# EAGLE design eth-denver-2021-badge (EAGLE 9.6.2)
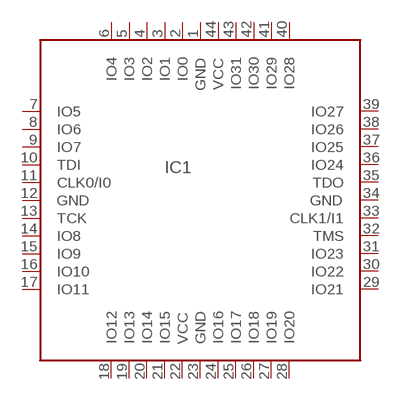
[diagram p0: schematic, sheet 1]

## Parts
IC1  M4-32-P44  [PLCC44]
Unconnected: IC1.2(IO0) IC1.3(IO1) IC1.4(IO2) IC1.5(IO3) IC1.6(IO4) IC1.7(IO5) IC1.8(IO6) IC1.9(IO7) IC1.10(TDI) IC1.11(CLK0/I0) IC1.13(TCK) IC1.14(IO8) IC1.15(IO9) IC1.16(IO10) IC1.17(IO11) IC1.18(IO12) IC1.19(IO13) IC1.20(IO14) IC1.21(IO15) IC1.24(IO16) IC1.25(IO17) IC1.26(IO18) IC1.27(IO19) IC1.28(IO20) IC1.29(IO21) IC1.30(IO22) IC1.31(IO23) IC1.32(TMS) IC1.33(CLK1/I1) IC1.35(TDO) IC1.36(IO24) IC1.37(IO25) IC1.38(IO26) IC1.39(IO27) IC1.40(IO28) IC1.41(IO29) IC1.42(IO30) IC1.43(IO31)

## Power pins joined to a net without a drawn wire
GND: IC1.1(GND) IC1.12(GND) IC1.23(GND) IC1.34(GND)
VCC: IC1.22(VCC) IC1.44(VCC)

## Library data of the parts
IC1 = amd-mach:M4-32-P44: AMD MACH SERIES; OC_FARNELL: unknown; OC_NEWARK: unknown

## Board
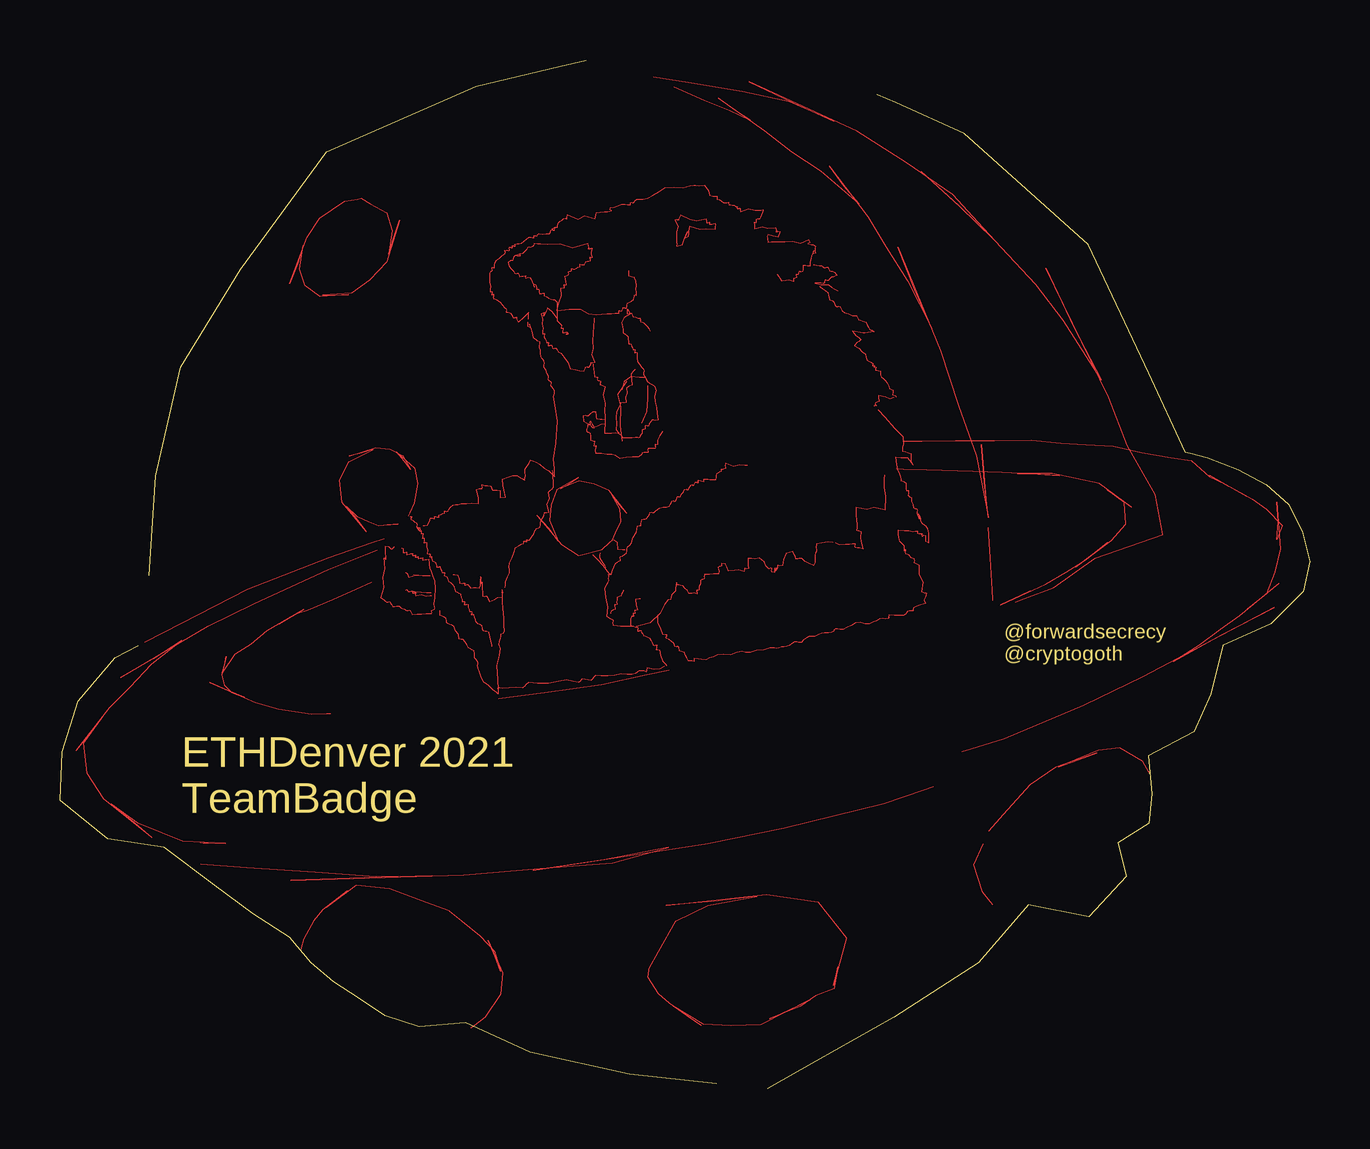
[diagram p1: board, top side]

Size 52.09 x 42.89 mm. Coordinates in mm from the lower left corner, seen from the top.
Outline: 3.72,21.4 3.99,25.55 5.03,30.1 7.54,34.17 11.12,39.07 17.35,41.81 20.84,42.64 21.92,42.89
Outline: 34.06,41.45 34.84,41.1 37.7,39.83 42.87,35.2 45.38,29.84 46.91,26.55 47.12,26.5 47.82,26.32 49.1,25.82 50.28,25.2 51.19,24.39 51.77,23.23 52.09,21.99 51.82,20.74 50.48,19.37 48.47,18.48 47.97,16.46 47.27,14.88 45.36,13.89 45.52,12.3 45.38,11.07 44.1,10.25 44.45,8.87 42.89,7.17 40.37,7.67 38.27,5.26 34.76,3 31.51,1.15 29.49,0
Outline: 27.36,0.22 23.74,0.61 19.6,1.53 16.91,2.75 14.98,2.59 13.56,3.05 12.46,3.78 11.41,4.46 10.46,5.26 9.57,6.32 8.05,7.3 6.45,8.49 4.34,10.08 1.99,10.42 0,12.04 0.1,14.06 0.76,16.17 2.31,17.99 3.27,18.48
Copper layers (1*16): Top 0.035mm / dielectric 1.5mm / Bottom 0.035mm
Design rules "default": minimum track width 6mil, minimum drill 0.35mm, track to track 6mil, track to pad 6mil, pad to pad 6mil, via to via 6mil, smd to smd 6mil, copper to edge 40mil, drill to drill 6mil, minimum pad ring 10mil, minimum via ring 8mil, stop-mask expansion 4mil, vias tented up to drill 0mil, thermal gap 10mil

### Footprints (pad centres in the part's own frame; a part is rotated, then mirrored left to right if it is on the bottom)
PLCC44 = smd 0.6 x 2.2: 1 0,8.1; 2 -1.27,8.1; 3 -2.54,8.1; 4 -3.81,8.1; 5 -5.08,8.1; 6 -6.35,8.1; 18 -6.35,-8.1; 19 -5.08,-8.1; 20 -3.81,-8.1; 21 -2.54,-8.1; 22 -1.27,-8.1; 23 0,-8.1; 24 1.27,-8.1; 25 2.54,-8.1; 26 3.81,-8.1; 27 5.08,-8.1; 28 6.35,-8.1; 40 6.35,8.1; 41 5.08,8.1; 42 3.81,8.1; 43 2.54,8.1; 44 1.27,8.1 | smd 2.2 x 0.6: 7 -8.1,6.35; 8 -8.1,5.08; 9 -8.1,3.81; 10 -8.1,2.54; 11 -8.1,1.27; 12 -8.1,0; 13 -8.1,-1.27; 14 -8.1,-2.54; 15 -8.1,-3.81; 16 -8.1,-5.08; 17 -8.1,-6.35; 29 8.1,-6.35; 30 8.1,-5.08; 31 8.1,-3.81; 32 8.1,-2.54; 33 8.1,-1.27; 34 8.1,0; 35 8.1,1.27; 36 8.1,2.54; 37 8.1,3.81; 38 8.1,5.08; 39 8.1,6.35

### Placement (x,y rotation side)
IC1  -39.39,-50.72 0 top  (outside the outline)

### Tracks (layer width: path | path; a pad name or v marks a point on that pad's centre or on a via)
GND  (3 unrouted)
N$1
  Top 0: 3.54,18.62 5.08,19.42 7.82,20.83 11.2,22.16 13,22.77 13.51,22.95
N$2
  Top 0: 15.46,20.67 15.29,20.68 15.05,20.7 14.8,20.72 14.72,20.73 14.71,20.73
N$3
  Top 0: 15.22,21.39 15.11,21.39 14.96,21.4 14.8,21.41 14.75,21.42 14.74,21.42
N$4
  Top 0: 13.63,23.52 13.68,23.52 13.78,23.53 14.1,23.56 13.27,23.48 12.87,23.63 12.41,23.83 11.94,24.28 12.34,23.8 12.75,23.23 11.76,24.44 11.66,25.39 12.06,26.14 13.06,26.66 12.57,26.51 12.06,26.39 13.16,26.74 13.76,26.68 14.27,26.4 14.62,25.83 14.34,26.18 14.03,26.56 14.79,25.89 14.9,25.24 14.75,24.42 14.56,24.01 14.5,23.88
N$5
  Top 0: 23.03,22.89 23.16,23.17 23.38,23.66 23.33,24.17 23.01,24.76 23.28,24.39 23.61,24 22.89,24.95 22.27,25.21 21.64,25.34 20.87,25.04 21.24,25.25 21.62,25.48 20.7,24.97 20.47,24.34 20.42,23.69 20.77,22.85 20.38,23.37 19.89,23.91 20.91,22.7 21.61,22.25 22.59,22.49 22.92,22.79 23.03,22.89
N$6
  Top 0: 22.19,22.29 22.38,22.09 22.63,21.82 22.87,21.51 22.96,21.45 22.97,21.45
N$7
  Top 0: 25.38,17.45 24.46,17.25 22.57,16.84 20.2,16.5 18.75,16.31 18.29,16.25
N$8
  Top 0: 13,21.12 12.34,20.82 11.37,20.39 10.32,19.95 9.92,19.82 9.85,19.8
N$9
  Top 0: 9.12,19.37 9.45,19.57 10.16,19.98 8.61,19.09 7.95,18.53 7.28,18.11 6.76,17.35 6.86,17.67 6.92,18.03 6.74,17.27 6.84,16.85 7.15,16.52 7.7,16.33 7,16.61 6.24,16.94 8.16,16.1 9.11,15.85 10.49,15.64 11.12,15.65 11.29,15.65
N$10
  Top 0: 40.45,20.76 40.05,20.57 39.19,20.17 41.09,21.04 41.94,21.54 42.79,22.06 43.65,22.78 43.04,22.29 42.34,21.75 43.82,22.86 44.43,23.55 44.36,24.46 43.65,24.96 44.13,24.63 44.65,24.26 43.32,25.23 42.35,25.46 41.36,25.66 39.91,25.66 40.75,25.63 41.66,25.58 39.26,25.71 38.06,25.74 36.12,25.81 35.15,25.83 34.87,25.83
N$11
  Top 0: 35.14,27 35.94,27.01 37.33,27.03 38.95,27.03 40.5,27.05 41.72,26.93 42.75,26.87 43.9,26.81 45.08,26.52 46.29,26.32 47.15,26.2 47.91,25.52 48.57,25.21 49.44,24.72 48.73,25.12 47.93,25.56 49.7,24.6 50.29,24.17 50.94,23.49 50.73,22.91 50.79,23.65 50.72,24.48 50.86,22.5 50.64,21.55 50.29,20.63 49.48,20 50.11,20.5 50.8,21.06 49.15,19.73 48.37,19.15 47.48,18.49 46.41,17.82 48.42,18.94 50.61,20.08 45.14,17.18 42.68,16 39.35,14.6 37.95,14.16 37.6,14.06
N$12
  Top 0: 5.85,10.27 5.96,10.27 6.19,10.25 6.91,10.23 5.12,10.31 4.24,10.67 3.26,11.07 2.13,11.89 2.94,11.23 3.83,10.48 1.83,12.09 1.14,13.16 0.99,14.42 1.76,15.5 1.25,14.83 0.68,14.11 2.08,15.91 2.92,16.77 3.83,17.71 5.08,18.69 3.89,17.93 2.54,17.16 6.17,19.3 8.08,20.23 11.18,21.65 12.75,22.28 13.21,22.47
N$13
  Top 0: 5.86,9.39 7.78,9.25 10.63,9.04 13.17,8.87 15.51,8.89 12.69,8.81 9.62,8.69 16.83,8.92 20.01,9.2 23.04,9.42 25.36,10.08 22.69,9.55 19.72,9.11 27.02,10.25 30.17,10.89 34.34,11.91 35.99,12.48 36.4,12.62
N$14
  Top 0: 24.55,5.01 24.95,5.71 25.69,7.02 27.01,7.65 29.06,8.03 27.26,7.82 25.26,7.65 29.44,8.12 31.59,7.79 32.78,6.31 32.25,4.31 32.36,4.78 32.43,5.08 32.26,4.18 31.5,3.89 30.86,3.45 29.57,2.93 30.38,3.3 31.25,3.72 29.22,2.68 27.97,2.62 26.81,2.69 25.55,3.46 26.12,3.07 26.71,2.65 25.41,3.57 24.95,3.96 24.51,4.66 24.54,4.94 24.55,5.01
N$15
  Top 0: 45.47,13.1 45.39,13.23 45.14,13.64 44.17,14.22 43.28,14.11 41.62,13.42 42.43,13.72 43.21,14 41.49,13.4 40.42,12.67 39.33,11.46 38.7,10.75
N$16
  Top 0: 38.47,10.23 38.08,9.35 38.43,8.24 38.77,7.82 38.87,7.69
N$17
  Top 0: 17.12,2.52 17.26,2.64 17.72,3 18.36,3.94 18.45,4.84 17.84,6.19 18.13,5.53 18.37,4.91 18.11,5.73 17.51,6.38 16.73,7.02 16.22,7.43 15.25,7.79 13.73,8.34 12.34,8.49 11.1,7.58 11.53,7.92 11.96,8.26 10.94,7.47 10.57,7.01 10.15,6.25 10.05,5.87 10.03,5.77
N$18
  Top 0: 24.38,29.65 24.15,29.66 23.79,29.69 23.5,29.5 23.42,29.16 23.5,29.32 23.61,29.49 23.25,28.94 23.36,28.45 23.35,27.64 23.4,27.16 23.42,27
N$19
  Top 0: 12.55,37.13 12.94,36.91 13.62,36.52 13.85,35.78 13.7,34.79 13.9,35.47 14.16,36.21 13.62,34.46 12.91,33.73 12.15,33.18 10.95,33.1 11.48,33.1 12.03,33.11 10.84,33.04 10.22,33.49 10,34.18 10.14,35.16 9.9,34.4 9.56,33.57 10.29,35.51 10.81,36.3 11.86,37.01 12.4,37.1 12.55,37.13
N$20
  Top 0: 39.82,20.31 40.19,20.45 41.42,20.91 43.16,22.14 45.96,23.11 45.66,24.77 44.49,26.82 43.71,28.81 41.09,34.23 42.25,31.74 43.4,29.56 41.82,32.04 40.67,33.54 39.25,35.07 38.5,35.87
N$21
  Top 0: 37.46,36.81 35.9,38.24 37.49,36.81 38.91,35.44 37.23,37.28 35.28,38.62 33.21,39.92 28.72,41.99 30.57,41.11 32.26,40.34 30.38,41.15 28.45,41.57 26.2,41.94 24.74,42.17
N$22
  Top 0: 25.6,41.79 26.86,41.23 27.9,40.8 28.78,40.39 28.14,40.8 27.45,41.31 29.36,39.94 30.49,39.08 31.69,38.28 33.31,36.9 32.68,37.64 32.07,38.46 33.68,36.37 34.43,35.12 35.32,33.7 36.34,31.7 35.64,33.3 34.92,35.09 36.71,30.77 37.46,28.48 38.2,26.38 38.7,23.82 38.53,25.29 38.41,26.87 38.54,25.35 38.62,24.33
N$23
  Top 0: 38.68,23.4 38.76,22.13 38.84,20.81 38.86,20.42 38.86,20.37
N$24
  Top 0: 15.13,23.49 15.19,23.49 15.32,23.5 15.41,23.65 15.46,23.79 15.53,23.8 15.57,23.79 15.61,23.78 15.62,23.81 15.61,23.83 15.61,23.87 15.68,23.86 15.73,23.85 15.79,23.84 15.8,23.87 15.79,23.89 15.8,23.93 15.88,23.95 15.95,23.99 16.03,24.01 16.04,24.05 16.03,24.07 16.03,24.1 16.08,24.1 16.11,24.08 16.18,24.09 16.21,24.18 16.29,24.26 16.38,24.33 16.49,24.36 16.6,24.36 16.73,24.41 16.94,24.41 17.16,24.43 17.45,24.4 17.44,24.65 17.4,24.79 17.37,24.98 17.48,25.02 17.53,25.03 17.6,25.04 17.61,25.09 17.59,25.13 17.59,25.2 17.72,25.15 17.82,25.15 17.95,25.14 17.98,25.07 17.99,25.03 18.02,24.97 18.12,24.96 18.21,24.97 18.34,24.95 18.33,24.81 18.35,24.66 18.56,24.68 18.52,24.96 18.47,25.15 18.45,25.43 18.67,25.51 18.86,25.57 19.06,25.56 19.19,25.48 19.26,25.44 19.37,25.39 19.4,25.57 19.38,25.69 19.39,25.84 19.48,25.97 19.56,26.08 19.62,26.21 19.75,26.17 19.84,26.13 19.99,26.05 20.18,25.89 20.36,25.79 20.61,25.52 20.62,25.74 20.61,25.86 20.58,26.26 20.67,26.93 20.73,27.85 20.64,28.5 20.58,28.86 20.62,28.99 20.62,29.12 20.56,29.2 20.52,29.26 20.48,29.3 20.47,29.36 20.49,29.4 20.48,29.45 20.44,29.48 20.4,29.51 20.36,29.55 20.35,29.6 20.36,29.64 20.36,29.72 20.31,29.83 20.25,29.97 20.18,30.07 20.17,30.18 20.19,30.26 20.19,30.34 20.14,30.4 20.1,30.46 20.04,30.54 20.02,30.66 20.04,30.8 20,30.91 19.99,31 20.01,31.06 20,31.14 19.91,31.17 19.84,31.24 19.73,31.31 19.71,31.44 19.68,31.59 19.66,31.68 19.56,31.88 19.6,31.74 19.5,31.77 19.51,31.84 19.51,31.9 19.52,31.94 19.52,31.96
N$25
  Top 0: 19.52,32.1 19.54,32.36 19.3,32.13 19.12,31.96 19.07,32.06 19.06,32.1 19.04,32.15 19,32.15 18.96,32.13 18.9,32.14 18.88,32.2 18.84,32.26 18.81,32.33 18.74,32.34 18.68,32.36 18.61,32.37 18.61,32.42 18.63,32.46 18.62,32.51 18.57,32.54 18.53,32.57 18.48,32.66 18.37,32.78 18.23,32.89 18.08,32.94 18.07,33.02 18.08,33.06 18.09,33.1 18.05,33.11 18.04,33.1 18.01,33.1 18.01,33.15 18.02,33.18 18.03,33.22 17.99,33.23 17.98,33.22 17.94,33.22 17.95,33.29 17.95,33.34 17.96,33.46 17.93,33.63 17.93,33.84 17.92,34.02 17.97,34.09 18,34.1 18.02,34.13 18.02,34.17 18.01,34.2 18.01,34.25 18.04,34.25 18.06,34.24 18.1,34.25 18.12,34.34 18.14,34.44 18.19,34.56 18.32,34.64 18.43,34.74 18.56,34.81 18.57,34.89 18.54,34.94 18.61,34.97 18.66,34.97 18.7,34.95 18.74,34.96 18.75,35.01 18.73,35.04 18.73,35.09 18.78,35.1 18.81,35.07 18.86,35.07 18.86,35.11 18.85,35.12 18.86,35.16 18.9,35.15 18.93,35.14 18.98,35.13 18.99,35.16 18.97,35.18 18.98,35.23 19.06,35.23 19.13,35.24 19.24,35.26 19.34,35.34 19.46,35.42 19.55,35.51 19.64,35.51 19.69,35.5 19.76,35.49 19.76,35.53 19.75,35.54 19.76,35.57 19.8,35.58 19.83,35.56 19.88,35.56 19.9,35.58 19.92,35.61 19.97,35.65 20.11,35.64 20.26,35.65 20.41,35.65 20.44,35.72 20.46,35.77 20.47,35.81 20.52,35.82 20.56,35.79 20.61,35.8 20.64,35.88 20.5,35.85 20.63,35.92 20.68,35.93 20.7,35.92 20.74,35.93 20.75,35.99 20.75,36.05 20.78,36.12 20.85,36.17 20.93,36.23 21,36.29 21.06,36.29 21.1,36.28 21.14,36.28 21.15,36.31 21.13,36.33 21.16,36.44 21.59,36.26 21.86,36.41 22.31,36.29 22.35,36.43 22.34,36.45 22.35,36.52 22.52,36.54 22.71,36.56 22.82,36.57 23,36.62 22.92,36.65 22.95,36.75 23.1,36.77 23.26,36.82 23.4,36.89 23.55,36.89 23.65,36.87 23.78,36.86 23.79,36.91 23.78,36.93 23.78,36.96 23.83,36.96 23.86,36.94 23.91,36.94 23.95,36.99 23.98,37.03 24.04,37.09 24.16,37.1 24.3,37.1 24.5,37.13 24.71,37.26 24.97,37.4 25.22,37.58 25.59,37.6 25.97,37.57 26.26,37.65 26.43,37.68 26.49,37.67 26.64,37.66 26.86,37.67 27.02,37.45 27.08,37.26 27.23,37.22 27.3,37.21 27.39,37.21 27.39,37.17 27.38,37.15 27.39,37.1 27.49,37.07 27.58,37.01 27.67,36.94 27.75,36.94 27.8,36.95 27.87,36.96 27.87,36.92 27.86,36.91 27.88,36.86 27.95,36.87 28.03,36.85 28.1,36.83 28.15,36.81 28.18,36.78 28.24,36.78 28.23,36.74 28.22,36.73 28.23,36.7 28.27,36.69 28.3,36.72 28.35,36.72 28.35,36.69 28.34,36.67 28.37,36.57 28.7,36.7 28.96,36.63 29.21,36.64 29.31,36.65 29.3,36.61 29.27,36.55 29.23,36.44 29.19,36.35 29.15,36.26 29.07,36.26 29.01,36.24 29,36.18 29.02,36.15 29.02,36.1 28.99,36.1 28.97,36.11 28.94,36.11 28.95,36.04 28.95,35.99 28.95,35.86 29.28,35.94 29.49,35.88 29.83,35.91 29.86,35.79 29.85,35.77 29.85,35.74 29.9,35.73 29.93,35.76 30.02,35.74 29.92,35.52 29.72,35.56 29.51,35.62 29.47,35.53 29.49,35.49 29.49,35.42 29.51,35.31 29.66,35.32 29.78,35.33 29.91,35.32 30.03,35.33 30.22,35.32 30.54,35.34 30.86,35.26 31.2,35.41 31.26,35.27 31.18,35.24 31.32,35.2 31.38,35.19 31.48,35.13 31.47,35.04 31.48,34.96 31.48,34.9 31.49,34.84 31.4,34.81 31.43,34.94 31.32,34.73 31.31,34.62 31.27,34.46 31.26,34.29 31.15,34.29 31.08,34.31 30.98,34.32 30.96,34.22 30.96,34.15 30.95,34.06 30.89,34.05 30.86,34.08 30.81,34.07 30.79,34.02 30.78,33.98 30.76,33.94 30.73,33.94 30.71,33.95 30.68,33.95 30.68,33.9 30.7,33.87 30.7,33.82 30.65,33.8 30.61,33.79 30.57,33.77 30.57,33.74 30.58,33.72 30.56,33.66 30.39,33.71 30.26,33.69 30.09,33.68 30.03,33.79 29.96,33.86 29.92,33.92 29.91,33.94
N$26
  Top 0: 20.72,32.44 20.74,32.54 20.8,32.79 20.91,33.06 20.88,33.38 20.98,33.41 21,33.4 21.03,33.4 21.03,33.45 21.01,33.48 21.01,33.52 21.04,33.53 21.06,33.52 21.11,33.53 21.09,33.66 21.07,33.75 21.05,33.88 21.12,33.91 21.16,33.92 21.21,33.94 21.21,33.99 21.19,34.02 21.19,34.07 21.24,34.09 21.28,34.1 21.32,34.11 21.33,34.14 21.32,34.16 21.32,34.19 21.36,34.19 21.4,34.18 21.46,34.18 21.53,34.22 21.6,34.26 21.68,34.28 21.69,34.32 21.68,34.34 21.68,34.38 21.75,34.37 21.8,34.36 21.86,34.35 21.88,34.4 21.9,34.44 21.92,34.49 21.98,34.51 22.04,34.52 22.11,34.53 22.11,34.59 22.09,34.62 22.09,34.67 22.12,34.67 22.14,34.66 22.19,34.67 22.16,34.8 22.16,34.89 22.19,35.03 22.12,35.03 22.09,35.02 22.04,35.01 22.04,35.05 22.05,35.06 22,35.24 21.37,35.04 20.85,35.21 20.33,35.19 20.03,35.22 19.9,35.22 19.77,35.23 19.73,35.16 19.7,35.12 19.65,35.08 19.6,35.08 19.56,35.1 19.49,35.08 19.45,34.99 19.37,34.9 19.28,34.83 18.98,34.74 19.16,34.81 19.17,34.71 19.09,34.72 19.04,34.73 18.97,34.73 18.91,34.67 18.89,34.61 18.86,34.53 18.78,34.53 18.68,34.46 18.73,34.31 18.81,34.19 18.9,34.1 18.95,34.01 19.02,33.99 19.05,34.02 19.1,34.01 19.12,33.96 19.13,33.92 19.16,33.87 19.24,33.87 19.31,33.89 19.4,33.9 19.4,33.86 19.39,33.84 19.4,33.81 19.46,33.82 19.52,33.83 19.6,33.83 19.64,33.75 19.67,33.66 19.69,33.59 19.77,33.43 19.74,33.56 19.83,33.53 19.84,33.46 19.86,33.41 19.86,33.34 19.9,33.34 19.92,33.35 19.96,33.34 19.96,33.28 19.97,33.22 19.99,33.15 20.06,33.15 20.11,33.17 20.18,33.18 20.19,33.14 20.18,33.12 20.18,33.07 20.27,33.03 20.37,32.97 20.47,32.92 20.55,32.9 20.61,32.91 20.72,32.81 20.71,32.56 20.72,32.27 20.72,32.02 20.82,31.92 20.87,31.89 20.9,31.85 20.9,31.8 20.89,31.76 20.89,31.72 20.92,31.71 20.94,31.73 20.98,31.72 20.96,31.65 20.95,31.61 20.95,31.53 21.03,31.53 21.08,31.55 21.14,31.55 21.18,31.49 21.1,31.47 21.16,31.48 21.2,31.48
  Top 0: 20.72,32.44 20.9,32.46 21.22,32.5 21.7,32.5 22.03,32.32 22.34,32.28 22.58,32.3 22.8,32.32 23,32.32 23.14,32.35 23.3,32.34 23.31,32.4 23.3,32.42 23.3,32.45 23.35,32.46 23.38,32.43 23.43,32.44 23.45,32.48 23.46,32.52 23.48,32.57 23.53,32.57 23.56,32.55 23.62,32.56 23.63,32.62 23.64,32.68 23.66,32.76 23.74,32.79 23.83,32.84 23.9,32.9 23.92,32.98 23.94,33.04 23.95,33.1 23.98,33.11 24,33.1 24.04,33.1 24.03,33.17 24.03,33.22 24.02,33.34 24.03,33.49 24,33.68 23.94,33.81 23.85,33.85 23.78,33.86 23.71,33.88 23.71,33.96 23.72,34.04 23.72,34.1 23.72,34.12 | 20.72,32.44 20.72,32.35 20.71,32.13 20.5,32.4 20.33,32.55 20.27,32.47 20.26,32.42 20.24,32.37 20.16,32.22 20.19,32.36 20.05,32.3 20.11,32.1 20.09,31.89 20.13,31.71 20.11,31.6 20.12,31.54 20.1,31.48 20.14,31.48 20.16,31.49 20.19,31.48 20.19,31.44 20.17,31.4 20.18,31.34 20.22,31.28 20.26,31.2 20.28,31.12 20.32,31.11 20.34,31.12 20.37,31.12 20.37,31.08 20.35,31.04 20.35,30.99 20.4,30.99 20.44,31.01 20.49,31.01 20.5,30.96 20.52,30.92 20.53,30.87 20.58,30.87 20.62,30.89 20.68,30.88 20.71,30.81 20.76,30.74 20.89,30.68 21.02,30.5 21.17,30.28 21.27,30.04 21.49,29.98 21.65,29.95 21.84,29.93 21.89,30.02 21.9,30.06 21.91,30.1 21.96,30.11 22,30.09 22.06,30.09 22.1,30.15 22.13,30.22 22.14,30.28 22.18,30.28 22.2,30.27 22.29,30.3 22.17,30.6 22.24,30.85 22.22,31.2 22.23,31.5 22.27,31.82 22.28,32.03 22.28,32.14
N$27
  Top 0: 24.62,31.6 24.58,31.67 24.49,31.79 24.35,31.92 24.22,31.97 24.2,32.04 24.21,32.06 24.2,32.1 24.1,32.11 24.01,32.15 23.91,32.18 23.88,32.24 23.87,32.28 23.85,32.33 23.78,32.33 23.73,32.31 23.65,32.31 23.66,32.38 23.66,32.44 23.66,32.48 23.66,32.5 23.69,32.45 23.76,32.3 23.5,32.16 23.41,31.95 23.44,31.78 23.46,31.66 23.47,31.54 23.54,31.48 23.61,31.43 23.68,31.36 23.68,31.25 23.7,31.16 23.7,31.06 23.74,31.05 23.76,31.07 23.81,31.06 23.82,30.98 23.86,30.91 23.88,30.82 23.92,30.81 23.94,30.82 23.97,30.82 23.97,30.77 23.96,30.74 23.95,30.7 23.99,30.69 24,30.71 24.06,30.69 24.04,30.57 24.06,30.46 24.08,30.33 24.16,30.22 24.24,30.1 24.32,30.01 24.33,29.92 24.31,29.86 24.32,29.78 24.38,29.69 24.44,29.59 24.5,29.49 24.58,29.43 24.67,29.38 24.78,29.3 24.83,29.1 24.79,28.89 24.8,28.66 24.87,28.4 24.88,28.18 24.93,27.88 24.8,27.86 24.75,27.88 24.67,27.88 24.61,27.8 24.55,27.72 24.52,27.63 24.46,27.62 24.43,27.64 24.38,27.64 24.37,27.59 24.39,27.56 24.39,27.51 24.34,27.49 24.3,27.48 24.26,27.46 24.25,27.42 24.27,27.38 24.27,27.33 24.22,27.27 24.18,27.21 24.15,27.15 24.11,27.14 24.07,27.15 23.98,27.16 23.84,27.14 23.66,27.13 23.48,27.13 23.42,27.25 23.29,27.31 23.15,27.34 23,27.33 22.88,27.32 22.72,27.32 22.72,27.53 22.74,27.68 22.74,27.88 22.6,27.91 22.51,27.9 22.39,27.92 22.37,28.02 22.36,28.1 22.35,28.21 22.19,28.21 22.08,28.14 22.01,28.05 21.94,28.05 21.9,28.07 21.81,28.05 21.82,27.85 21.97,27.76 22.1,27.71 22.14,27.64 22.19,27.57 22.24,27.57 22.28,27.58
N$28
  Top 0: 25.11,27.4 25.07,27.35 24.99,27.22 24.91,27.06 24.91,26.86 24.84,26.85 24.83,26.86 24.79,26.86 24.8,26.81 24.81,26.78 24.81,26.71 24.69,26.7 24.61,26.69 24.5,26.7 24.49,26.63 24.51,26.6 24.51,26.53 24.42,26.52 24.35,26.52 24.27,26.51 24.24,26.45 24.2,26.41 24.1,26.34 23.86,26.35 23.59,26.33 23.34,26.28 23.22,26.36 23.15,26.4 23.01,26.46 22.8,26.45 22.58,26.48 22.34,26.5 22.33,26.64 22.35,26.7 22.36,26.79 22.32,26.8 22.3,26.79 22.27,26.79 22.28,26.86 22.29,26.91 22.29,26.98 22.24,27 22.2,27.01 22.14,27.04 22.13,27.14 22.13,27.23 22.12,27.33 22.06,27.36 22.02,27.37 21.96,27.4 21.97,27.51 22,27.59 22.02,27.69 22.06,27.7 22.08,27.69 22.12,27.7 22.11,27.75 22.09,27.79 22.12,27.85 22.17,27.72 22.22,27.66 22.26,27.6
N$29
  Top 0: 22.22,30.22 22.23,30.16 22.24,30.03 22.27,29.86 22.29,29.69 22.36,29.67 22.38,29.68 22.41,29.68 22.41,29.63 22.39,29.6 22.4,29.55 22.44,29.53 22.48,29.52 22.53,29.5 22.53,29.46 22.51,29.42 22.52,29.37 22.56,29.35 22.6,29.34 22.72,29.28 22.64,28.93 22.71,28.59 22.7,28.25 22.71,28.03 22.71,27.89 22.72,27.73 22.56,27.69 22.43,27.63 22.33,27.59
N$30
  Top 0: 23.96,29.98 23.92,29.93 23.8,29.8 23.81,29.56 23.84,29.34 23.74,29.29 23.7,29.29 23.62,29.22 23.64,29.02 23.56,28.84 23.6,28.6 23.5,28.59 23.46,28.61 23.37,28.59 23.3,28.42 23.21,28.23 23.17,27.99 23.19,27.74 23.18,27.49 23.27,27.38 23.3,27.34
N$31
  Top 0: 24.26,27.76 24.33,27.91 24.46,28.24 24.5,28.77 24.5,29.13 24.5,29.32
N$32
  Top 0: 25.95,35.2 26.04,35.45 26.15,35.74 26.03,35.47 26.21,35.55 26.22,35.66 26.21,35.77 26.26,35.96 26.68,35.84 26.93,35.86 27.33,35.84 27.33,35.97 27.34,36.01 27.33,36.06 27.24,36.05 27.18,36.04 27.09,36.02 27.08,36.07 27.09,36.08 27.09,36.12 27.04,36.12 27.01,36.09 26.97,36.1 26.96,36.13 26.97,36.15 26.94,36.26 26.53,36.18 26.26,36.24 25.87,36.43 25.8,36.31 25.79,36.27 25.78,36.23 25.75,36.22 25.73,36.23 25.64,36.21 25.75,35.94 25.69,35.73 25.71,35.5 25.71,35.37 25.7,35.29 25.71,35.22 25.7,35.18 25.69,35.16 25.72,35.13 25.79,35.16 25.87,35.18 25.92,35.2 25.95,35.2
N$33
  Top 0: 31.41,34.36 31.45,34.36 31.53,34.35 31.65,34.33 31.75,34.32 31.8,34.29 31.81,34.26 31.84,34.23 31.9,34.24 31.95,34.25 32.02,34.25 32.04,34.2 32.05,34.16 32.07,34.11 32.13,34.1 32.2,34.09 32.28,34.05 32.39,33.93 32.25,33.85 32.15,33.85 32.09,33.79 32.06,33.74 32.02,33.7 31.97,33.7 31.93,33.72 31.89,33.71 31.87,33.66 31.86,33.62 31.83,33.56 31.72,33.59 31.65,33.58 31.48,33.59 31.73,33.53 31.84,33.54 32.03,33.54 32.16,33.42 32.29,33.33 32.39,33.3 32.43,33.28
N$34
  Top 0: 31.65,33.46 31.69,33.43 31.77,33.36 31.9,33.28 32.01,33.2 32.03,33.08 32.06,33.01 32.06,32.91 32.13,32.89 32.2,32.87 32.26,32.81 32.28,32.74 32.31,32.67 32.36,32.62 32.42,32.62 32.46,32.63 32.52,32.62 32.55,32.53 32.59,32.45 32.69,32.36 32.87,32.33 33.03,32.24 33.2,32.23 33.24,32.16 33.25,32.12 33.28,32.07 33.37,32.05 33.47,32.01 33.59,31.97 33.64,31.86 33.69,31.76 33.73,31.67 33.79,31.64 33.84,31.63 33.93,31.58 33.56,31.5 33.46,31.5 33.03,31.6 33.18,31.41 33.29,31.34 33.37,31.27 33.4,31.24
N$35
  Top 0: 33.36,31.21 33.3,31.16 33.21,31.11 33.12,30.98 33.31,30.89 33.42,30.75 33.57,30.63 33.6,30.52 33.61,30.46 33.63,30.39 33.72,30.35 33.8,30.29 33.88,30.25 33.88,30.2 33.87,30.18 33.87,30.15 33.9,30.15 33.91,30.16 33.94,30.16 33.94,30.14 33.93,30.12 33.93,30.09 33.96,30.09 33.97,30.1 34.01,30.1 34,30.05 33.99,30.02 33.99,29.97 34.06,29.96 34.11,29.94 34.19,29.92 34.2,29.84 34.21,29.76 34.23,29.67 34.32,29.61 34.4,29.53 34.48,29.45 34.52,29.36 34.55,29.27 34.58,29.2 34.64,29.17 34.68,29.16 34.73,29.14 34.73,29.07 34.71,29.02 34.71,28.95 34.77,28.93 34.83,28.9 34.83,28.86 34.84,28.84
N$36
  Top 0: 34.77,28.81 34.6,28.75 34.4,28.85 34.12,28.9 34.11,28.77 34.13,28.72 34.13,28.65 34.08,28.63 34.04,28.62 33.99,28.6 33.97,28.54 34.02,28.48 33.97,28.48 33.94,28.48
N$37
  Top 0: 34.09,28.32 34.38,28.02 34.79,27.55 35.14,27.2 35.15,26.89 35.11,26.76 35.11,26.6 35.25,26.56 35.34,26.52 35.48,26.5 35.48,26.31 35.48,26.15 35.54,26.05 35.56,26.01
N$38
  Top 0: 13.93,22.59 13.9,22.56 13.83,22.5 13.71,22.59 13.55,22.62 13.55,22.45 13.56,22.3 13.57,22.22 13.58,22.07 13.56,22.14 13.49,22.1 13.5,22.01 13.5,21.91 13.52,21.7 13.45,21.32 13.48,20.9 13.37,20.49 13.5,20.38 13.56,20.35 13.62,20.3 13.67,20.3 13.71,20.32 13.76,20.31 13.79,20.25 13.83,20.19 13.86,20.12 13.95,20.11 14.03,20.13 14.13,20.13 14.23,20.06 14.35,20.01 14.44,19.95 14.51,19.94 14.55,19.96 14.6,19.95 14.62,19.91 14.63,19.86 14.67,19.78 14.88,19.8 15.08,19.8 15.26,19.83 15.38,19.82 15.43,19.82 15.5,19.81 15.5,19.87 15.48,19.9 15.49,19.95 15.53,19.97 15.57,19.98 15.62,20 15.63,20.04 15.62,20.08 15.6,20.23 15.64,20.49 15.65,20.85 15.64,21.17 15.55,21.39 15.5,21.57 15.43,21.71 15.42,21.85 15.4,21.95 15.39,22.06 15.29,22.06 15.22,22.04 15.13,22.03 15.13,22.07 15.14,22.09 15.13,22.12 15.06,22.11 15.02,22.1 14.95,22.09 14.95,22.13 14.96,22.15 14.95,22.18 14.91,22.18 14.88,22.16 14.83,22.16 14.83,22.19 14.84,22.21 14.83,22.24 14.79,22.24 14.76,22.22 14.71,22.22 14.71,22.25 14.72,22.27 14.71,22.31 14.62,22.29 14.56,22.28 14.47,22.27 14.47,22.31 14.48,22.33 14.47,22.36 14.43,22.36 14.39,22.34 14.33,22.35 14.32,22.42 14.32,22.51 14.26,22.52 14.23,22.53
N$39
  Top 0: 15.49,20.55 15.42,20.54 15.25,20.54 15.06,20.59 14.84,20.55 14.83,20.63 14.84,20.65 14.83,20.68 14.79,20.67 14.76,20.66 14.71,20.66 14.71,20.69 14.72,20.71 14.71,20.74 14.64,20.73 14.6,20.72 14.53,20.72 14.51,20.76 14.47,20.8 14.44,20.79 14.41,20.79
N$40
  Top 0: 15.43,21.39 15.34,21.39 15.12,21.39 14.85,21.4 14.56,21.33 14.5,21.44 14.48,21.5 14.44,21.5 14.41,21.51
N$41
  Top 0: 16.39,21.45 16.45,21.44 16.58,21.44 16.64,21.25 16.65,21.08 16.76,21.08 16.81,21.09 16.87,21.1 16.88,21.07 16.87,21.05 16.87,21.02 16.92,21.02 16.95,21.03 17,21.03 17.04,20.99 17.07,20.94 17.12,20.89 17.24,20.9 17.35,20.9 17.48,20.89 17.53,20.99 17.54,21.09 17.53,21.18 17.54,21.26 17.56,21.29 17.54,21.34 17.52,21.31 17.53,21.29 17.54,21.26 17.53,21.21 17.53,21.15 17.52,21.08 17.59,21.05 17.6,21.13 17.59,20.95 17.6,20.86 17.62,20.7 17.62,20.55 17.7,20.54 17.73,20.56 17.79,20.55 17.82,20.49 17.85,20.43 17.91,20.32 18.11,20.4 18.25,20.48 18.44,20.51 18.44,20.61 18.44,20.66 18.43,20.72 18.44,20.75 18.45,20.77 18.44,20.79 18.42,20.77 18.43,20.75 18.44,20.7 18.44,20.63 18.44,20.53 18.44,20.33 18.45,20.03 18.49,19.63 18.49,19.31 18.51,19.09 18.46,18.98 18.37,18.95 18.36,18.85 18.35,18.77 18.31,18.67 18.29,18.52 18.34,18.36 18.3,18.08 18.19,17.65 18.24,17.06 18.25,16.65 18.26,16.46 18.19,16.52 18.05,16.64 17.86,16.82 17.66,16.97 17.56,17.19 17.49,17.39 17.42,17.56 17.41,17.66 17.42,17.72 17.42,17.79 17.38,17.85 17.34,17.9 17.28,17.97 17.27,18.07 17.28,18.17 17.25,18.26 17.18,18.3 17.12,18.34 17.03,18.39 16.97,18.51 16.88,18.63 16.8,18.74 16.73,18.75 16.71,18.74 16.64,18.76 16.61,18.94 16.49,19.1 16.43,19.28 16.31,19.33 16.23,19.36 16.15,19.4 16.12,19.46 16.12,19.52 16.09,19.61 16,19.68 15.85,19.74 15.85,19.87 15.85,19.95
N$42
  Top 0: 18.56,20.91 18.57,20.98 18.58,21.14 18.66,21.35 18.74,21.52 18.73,21.66 18.72,21.76 18.74,21.93 18.85,22.12 18.92,22.37 19,22.58 19.14,22.65 19.23,22.71 19.33,22.74 19.34,22.79 19.33,22.81 19.34,22.84 19.38,22.84 19.41,22.82 19.46,22.82 19.46,22.85 19.45,22.87 19.45,22.89 19.48,22.9 19.5,22.89 19.57,22.89 19.66,23.01 19.75,23.15 19.8,23.29 19.86,23.37 19.94,23.38 20.01,23.42 20.04,23.51 20.04,23.59 20.06,23.69 20.12,23.8 20.17,23.91 20.2,24.02 20.26,24.04 20.28,24.02 20.38,24.05 20.3,24.37 20.41,24.61 20.37,24.88 20.46,24.98 20.51,25 20.58,25.1 20.57,25.29 20.55,25.53 20.54,25.69 20.54,25.77
N$43
  Top 0: 36.22,22.77 36.22,22.83 36.21,22.97 36.21,23.17 36.18,23.35 36.09,23.46 36,23.53 35.92,23.6 35.89,23.69 35.88,23.77 35.87,23.85 35.78,23.97 35.83,23.75 35.74,23.99 35.74,24.07 35.75,24.11 35.74,24.16 35.7,24.18 35.66,24.19 35.59,24.23 35.56,24.37 35.51,24.49 35.52,24.63 35.46,24.66 35.41,24.69 35.37,24.74 35.38,24.82 35.39,24.87 35.39,24.93 35.36,24.94 35.34,24.93 35.29,24.94 35.29,25.04 35.28,25.13 35.27,25.23 35.2,25.3 35.14,25.32 35.07,25.34 35.07,25.42 35.05,25.5 35.01,25.63 34.93,25.83 34.88,26.04 34.84,26.33 35.04,26.32 35.17,26.33 35.33,26.33 35.4,26.21 35.48,26.12 35.53,26.05
N$44
  Top 0: 36.17,22.8 36.08,22.85 36.07,22.97 36.06,23.07 36,23.09 35.96,23.05 35.92,23.06 35.91,23.09 35.92,23.11 35.92,23.15 35.86,23.15 35.8,23.16 35.74,23.17 35.73,23.21 35.74,23.23 35.74,23.26 35.7,23.27 35.66,23.26 35.56,23.24 35.39,23.27 35.19,23.27 34.94,23.3 34.95,23.12 34.96,22.99 35,22.83 35.09,22.73 35.19,22.64 35.2,22.58 35.19,22.43 35.21,22.5 35.27,22.48 35.27,22.43 35.25,22.39 35.26,22.31 35.39,22.26 35.49,22.14 35.61,22.09 35.63,22.01 35.61,21.97 35.61,21.92 35.66,21.9 35.7,21.89 35.83,21.82 35.83,21.46 35.99,21.13 35.92,20.72 36.06,20.66 36.08,20.67 36.14,20.66 36.1,20.5 36.03,20.38 36.08,20.29 36.1,20.25 36.02,20.22 35.87,20.18 35.7,20.11 35.57,20.05 35.55,19.98 35.57,19.97 35.55,19.92 35.47,19.93 35.4,19.92 35.32,19.9 35.29,19.85 35.26,19.8 35.16,19.74 34.96,19.75 34.77,19.73 34.55,19.76 34.53,19.68 34.54,19.67 34.53,19.61 34.41,19.59 34.3,19.61 34.16,19.59 34.04,19.51 33.9,19.46 33.75,19.39 33.55,19.39 33.36,19.44 33.15,19.42 32.98,19.31 32.8,19.24 32.65,19.16 32.51,19.16 32.42,19.18 32.32,19.18 32.27,19.13 32.24,19.08 32.17,19.02 32.03,19.02 31.87,19.01 31.73,19 31.63,18.95 31.56,18.9 31.48,18.86 31.39,18.86 31.31,18.87 31.21,18.87 31.1,18.8 30.99,18.71 30.9,18.62 30.79,18.61 30.71,18.63 30.61,18.63 30.51,18.56 30.4,18.49 30.28,18.44 30.17,18.43 30.07,18.42 29.98,18.38 29.87,18.37 29.77,18.39 29.59,18.38 29.35,18.31 29.03,18.28 28.77,18.2 28.57,18.2 28.43,18.23 28.21,18.19 27.96,18.09 27.65,18.12 27.4,18.1 27.23,18.01 27.06,17.98 26.92,17.89 26.74,17.9 26.6,17.92 26.44,17.95 26.42,17.88 26.43,17.86 26.43,17.82 26.34,17.84 26.27,17.84 26.21,17.84 26.19,17.84
N$45
  Top 0: 34.36,25.59 34.35,25.44 34.34,25.1 34.4,24.69 34.39,24.14 33.92,24.24 33.63,24.15 33.19,24.23 33.18,23.93 33.19,23.72 33.22,23.54 33.21,23.43 33.21,23.37 33.21,23.31 33.26,23.29 33.3,23.27 33.38,23.23 33.36,22.99 33.39,22.83 33.46,22.51 33.32,22.54 33.25,22.56 33.15,22.57 33.14,22.63 33.17,22.67 33.16,22.72 33.09,22.71 33.04,22.71 32.92,22.7 32.73,22.71 32.49,22.67 32.36,22.74 32.31,22.77
N$46
  Top 0: 32.21,22.78 32.02,22.8 31.76,22.77 31.54,22.71 31.52,22.57 31.54,22.49 31.54,22.4 31.49,22.34 31.47,22.25 31.47,22.16 31.47,22.05 31.47,21.95 31.41,21.83 31.21,21.9 31.06,21.98 30.92,22.11 30.81,22.11 30.75,22.1 30.67,22.1 30.65,22.19 30.62,22.27 30.56,22.41 30.27,22.32 30.16,22.07 30.11,21.83 29.99,21.79 29.96,21.82 29.91,21.82 29.9,21.79 29.91,21.77 29.91,21.72 29.83,21.59 29.87,21.73 29.77,21.69 29.79,21.62 29.77,21.52 29.67,21.55 29.66,21.61 29.68,21.65 29.68,21.7 29.61,21.71 29.55,21.68 29.43,21.81 29.37,21.98 29.15,22.13 28.97,22.1 28.83,22.11 28.77,22.12 28.67,22.11 28.68,21.95 28.68,21.84 28.69,21.69 28.61,21.68 28.57,21.7 28.53,21.7 28.53,21.67 28.54,21.65 28.51,21.57 28.28,21.63 28.1,21.61 27.87,21.59 27.8,21.75 27.75,21.88 27.58,21.91 27.56,21.85 27.57,21.83 27.57,21.8 27.53,21.79 27.49,21.77 27.43,21.75 27.44,21.66 27.46,21.59 27.46,21.46 27.23,21.47 27.07,21.44 26.86,21.44 26.84,21.35 26.86,21.31 26.85,21.26 26.81,21.24 26.77,21.23 26.7,21.2 26.7,21.06 26.63,20.94 26.64,20.79 26.59,20.78 26.57,20.79 26.54,20.79 26.54,20.74 26.56,20.71 26.55,20.64 26.44,20.67 26.35,20.66 26.22,20.66 26.16,20.78 26.06,20.87 25.98,20.97 25.86,20.99 25.79,21.02 25.71,21.01 25.7,21.05 25.72,21.07 25.69,21.11 25.67,20.97 25.66,20.9 25.65,20.77 25.58,20.68 25.5,20.59 25.47,20.49 25.44,20.4 25.34,20.38 25.19,20.19 25.01,19.83 24.59,19.42 24.21,19.33 24.02,19.28
N$47
  Top 0: 23.9,19.28 23.66,19.28 23.36,19.28 23.08,19.32 23.05,19.45 23.07,19.48 23.06,19.54 23,19.57 22.94,19.6 22.8,19.69 22.84,20.08 22.77,20.48 22.71,20.87 22.8,21.05 22.85,21.12 22.89,21.2 22.87,21.29 22.88,21.36 22.86,21.45 22.9,21.45 22.92,21.44 22.99,21.46 23.03,21.62 23.1,21.77 23.15,21.91 23.24,21.97 23.3,22.01 23.36,22.03 23.37,22.09 23.35,22.13 23.36,22.19 23.45,22.22 23.53,22.27 23.61,22.34 23.63,22.43 23.64,22.51 23.65,22.58 23.7,22.63 23.75,22.66 23.83,22.76 23.89,22.99 24.03,23.22 24.07,23.47 24.16,23.5 24.18,23.48 24.22,23.49 24.22,23.58 24.24,23.65 24.25,23.74 24.32,23.76 24.39,23.76 24.46,23.79 24.5,23.87 24.56,23.95 24.6,24.03 24.66,24.04 24.7,24.03 24.77,24.03 24.83,24.09 24.9,24.15 24.99,24.23 25.13,24.25 25.27,24.26 25.4,24.31 25.45,24.39 25.48,24.45 25.51,24.51 25.57,24.53 25.6,24.49 25.66,24.51 25.69,24.57 25.72,24.63 25.75,24.69 25.79,24.7 25.81,24.69 25.86,24.7 25.9,24.8 25.99,24.89 26.03,24.98 26.11,25.01 26.14,24.98 26.2,24.99 26.22,25.05 26.26,25.11 26.29,25.17 26.35,25.19 26.38,25.16 26.43,25.17 26.45,25.21 26.46,25.25 26.48,25.3 26.53,25.31 26.56,25.28 26.61,25.28 26.61,25.31 26.6,25.33 26.61,25.37 26.7,25.36 26.76,25.35 26.85,25.33 26.85,25.37 26.84,25.39 26.85,25.43 26.93,25.42 27,25.42 27.09,25.41 27.17,25.41 27.25,25.4 27.34,25.4 27.36,25.5 27.36,25.57 27.38,25.66 27.45,25.7 27.51,25.73 27.57,25.75 27.57,25.79 27.56,25.81 27.57,25.85 27.63,25.85 27.68,25.87 27.75,25.88 27.76,25.94 27.74,25.97 27.76,26.08 28.07,25.97 28.32,26.03 28.56,26.02 28.65,26.01
N$48
  Top 0: 23.48,20.79 23.47,20.76 23.45,20.7 23.41,20.62 23.38,20.55 23.33,20.52 23.28,20.51 23.22,20.48 23.21,20.38 23.2,20.29 23.21,20.19 23.16,20.18 23.14,20.19 23.11,20.19 23.12,20.12 23.13,20.07 23.13,19.99 23.05,19.96 22.97,19.91 22.95,19.85 22.94,19.83
N$49
  Top 0: 24.2,20.43 24.15,20.42 23.99,20.4 24,20.17 24.08,19.96 24,19.94 23.99,19.95 23.95,19.95 23.96,19.9 23.97,19.87 23.97,19.82 23.94,19.82 23.93,19.83 23.89,19.83 23.9,19.78 23.91,19.75 23.91,19.7 23.88,19.7 23.86,19.71 23.81,19.7 23.79,19.6 23.78,19.48 23.78,19.39 23.78,19.34 23.89,19.31 23.98,19.27 24.08,19.25 24.1,19.18 24.08,19.15 24.08,19.1 24.13,19.1 24.16,19.12 24.22,19.11 24.25,19.04 24.29,18.98 24.32,18.91 24.41,18.88 24.49,18.85 24.58,18.8 24.63,18.7 24.68,18.6 24.72,18.51 24.79,18.49 24.82,18.52 24.88,18.51 24.87,18.44 24.86,18.39 24.85,18.32 24.89,18.32 24.9,18.33 25,18.31 25.03,18.08 25.11,17.85 25.23,17.72 25.29,17.66
N$50
  Top 0: 26.17,17.88 26.13,17.97 26.07,18.08 26.04,18.2 25.95,18.22 25.89,18.25 25.83,18.25 25.82,18.28 25.82,18.3 25.83,18.33 25.81,18.37 25.8,18.41 25.77,18.45 25.72,18.45 25.69,18.44 25.64,18.44 25.62,18.48 25.61,18.52 25.57,18.59 25.49,18.66 25.39,18.73 25.29,18.77 25.27,18.85 25.3,18.88 25.3,18.93 25.26,18.93 25.25,18.92 25.13,18.95 25.05,19.19 24.94,19.46 24.93,19.66 24.92,19.77
N$51
  Top 0: 25.21,17.62 25.02,17.51 24.76,17.49 24.46,17.56 24.44,17.46 24.45,17.44 24.44,17.39 24.33,17.42 24.25,17.43 24.14,17.43 24.07,17.38 23.99,17.33 23.85,17.28 23.64,17.27 23.38,17.3 23.12,17.24 22.84,17.21 22.56,17.22 22.33,17.23 22.24,17.15 22.21,17.1 22.14,17.04 22.02,17.05 21.89,17.08 21.77,17.09 21.72,17.04 21.71,17.02 21.61,16.95 21.39,16.99 21.12,17.05 20.78,16.99 20.36,16.91 19.91,16.89 19.54,16.95 19.41,16.84 19.39,16.79 19.28,16.72 19.02,16.75 18.71,16.72 18.45,16.69 18.33,16.71 18.29,16.73 18.24,16.69 18.25,16.62 18.25,16.54 18.25,16.49
N$52
  Top 0: 18.02,18.44 18,18.51 17.97,18.65 17.93,18.84 17.88,19.03 17.78,19.07 17.71,19.08 17.65,19.1 17.62,19.16 17.62,19.22 17.6,19.3 17.51,19.35 17.42,19.38 17.34,19.46 17.33,19.57 17.29,19.67 17.27,19.76 17.21,19.77 17.2,19.76 17.16,19.76 17.16,19.81 17.19,19.84 17.19,19.89 17.15,19.89 17.14,19.88 17.09,19.89 17.07,19.99 17.04,20.08 17.02,20.19 16.95,20.2 16.92,20.18 16.87,20.18 16.87,20.23 16.88,20.26 16.88,20.31 16.85,20.31 16.84,20.3 16.79,20.31 16.79,20.41 16.75,20.5 16.71,20.6 16.63,20.65 16.57,20.69 16.51,20.72 16.49,20.78 16.47,20.84 16.45,20.93 16.38,21.01 16.3,21.08 16.21,21.13 16.19,21.21 16.18,21.27 16.16,21.33 16.11,21.35 16.07,21.36 16.03,21.38 16.02,21.43 16.04,21.46 16.04,21.51 16.01,21.51 15.99,21.5 15.95,21.51 15.94,21.59 15.89,21.66 15.87,21.75 15.81,21.76 15.78,21.74 15.72,21.74 15.71,21.81 15.69,21.87 15.68,21.93 15.63,21.95 15.59,21.96 15.54,21.99 15.53,22.05 15.51,22.1 15.51,22.17 15.47,22.17 15.45,22.16 15.42,22.17 15.42,22.21 15.44,22.24 15.44,22.29 15.41,22.29 15.39,22.28 15.33,22.3 15.34,22.46 15.31,22.59 15.3,22.76 15.23,22.77 15.21,22.76 15.18,22.77 15.19,22.84 15.2,22.88 15.21,22.95 15.17,22.95 15.15,22.94 15.12,22.95 15.13,23.02 15.14,23.06 15.15,23.13 15.11,23.13 15.09,23.12 15.06,23.13 15.06,23.17 15.08,23.2 15.08,23.25 15.05,23.25 15.03,23.24 15,23.25 15,23.29 15.02,23.33 15.02,23.38 14.93,23.41 14.97,23.27 14.89,23.41 14.89,23.47 14.91,23.51 14.89,23.57 14.81,23.61 14.73,23.67 14.65,23.71 14.63,23.79 14.68,23.85 14.62,23.85 14.59,23.85
N$53
  Top 0: 23.54,22.47 23.44,22.48 23.26,22.49 23.25,22.78 23.12,22.85 23.06,22.89
N$54
  Top 0: 22.76,21.75 22.71,21.82 22.64,21.94 22.51,22.12 22.52,22.26 22.52,22.35
VCC  (1 unrouted)

### Text on the board
Dimension: @forwardsecrecy / @cryptogoth | ETHDenver 2021 / TeamBadge